# Altium schematic sheet QuadSPIFlash.SchDoc
size 203 x 101 mm; SheetNumber: 11; SheetTotal: 11
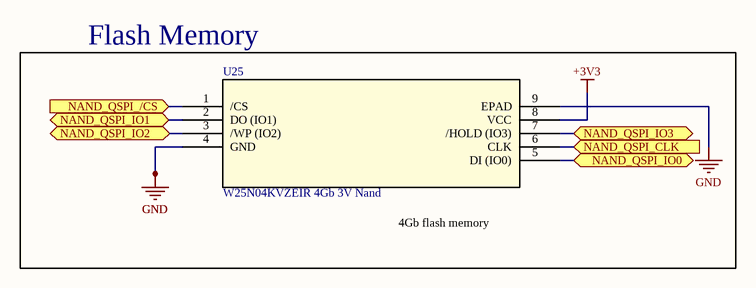
[diagram p0: QuadSPIFlash.SchDoc]

## Parts
U25  W25N04KVZEIR 4Gb 3V Nand  [W25N04KVZEIR 4Gb 3V Nand-Footprint-1]

## Blocks framed on the sheet
Flash Memory: U25

## Ports
NAND_QSPI_/CS (in, see TopLevel[5D]), NAND_QSPI_CLK (in, see TopLevel[5D]), NAND_QSPI_IO0 (bidir, see TopLevel[6D]), NAND_QSPI_IO1 (bidir, see TopLevel[6D]), NAND_QSPI_IO2 (bidir, see TopLevel[6D]), NAND_QSPI_IO3 (bidir, see TopLevel[6D])

## Nets
+3V3: U25.8(VCC)
GND: U25.4(GND) U25.9(EPAD)
NAND_QSPI_/CS: U25.1(/CS) ; port NAND_QSPI_/CS
NAND_QSPI_CLK: U25.6(CLK) ; port NAND_QSPI_CLK
NAND_QSPI_IO0: U25.5(DI_(IO0)) ; port NAND_QSPI_IO0
NAND_QSPI_IO1: U25.2(DO_(IO1)) ; port NAND_QSPI_IO1
NAND_QSPI_IO2: U25.3(/WP_(IO2)) ; port NAND_QSPI_IO2
NAND_QSPI_IO3: U25.7(/HOLD_(IO3)) ; port NAND_QSPI_IO3

## Notes on the sheet
- 4Gb flash memory

## Library data of the parts
U25 = CMP-019-00067-2: 4G-BIT Serial Nand Flash, 3V